# EasyEDA Pro project 工创扩展板.eprj

# Schematic Schematic1
Board Name: Board1; Create Date: 2025-02-19; Page Name: GPIO扩展功能; Project Name: 工创扩展板(1); Schematic Name: Schematic1; Update Date: 2025-02-20; Company: 嘉立创EDA; Page Size: A4; Version: V1.0
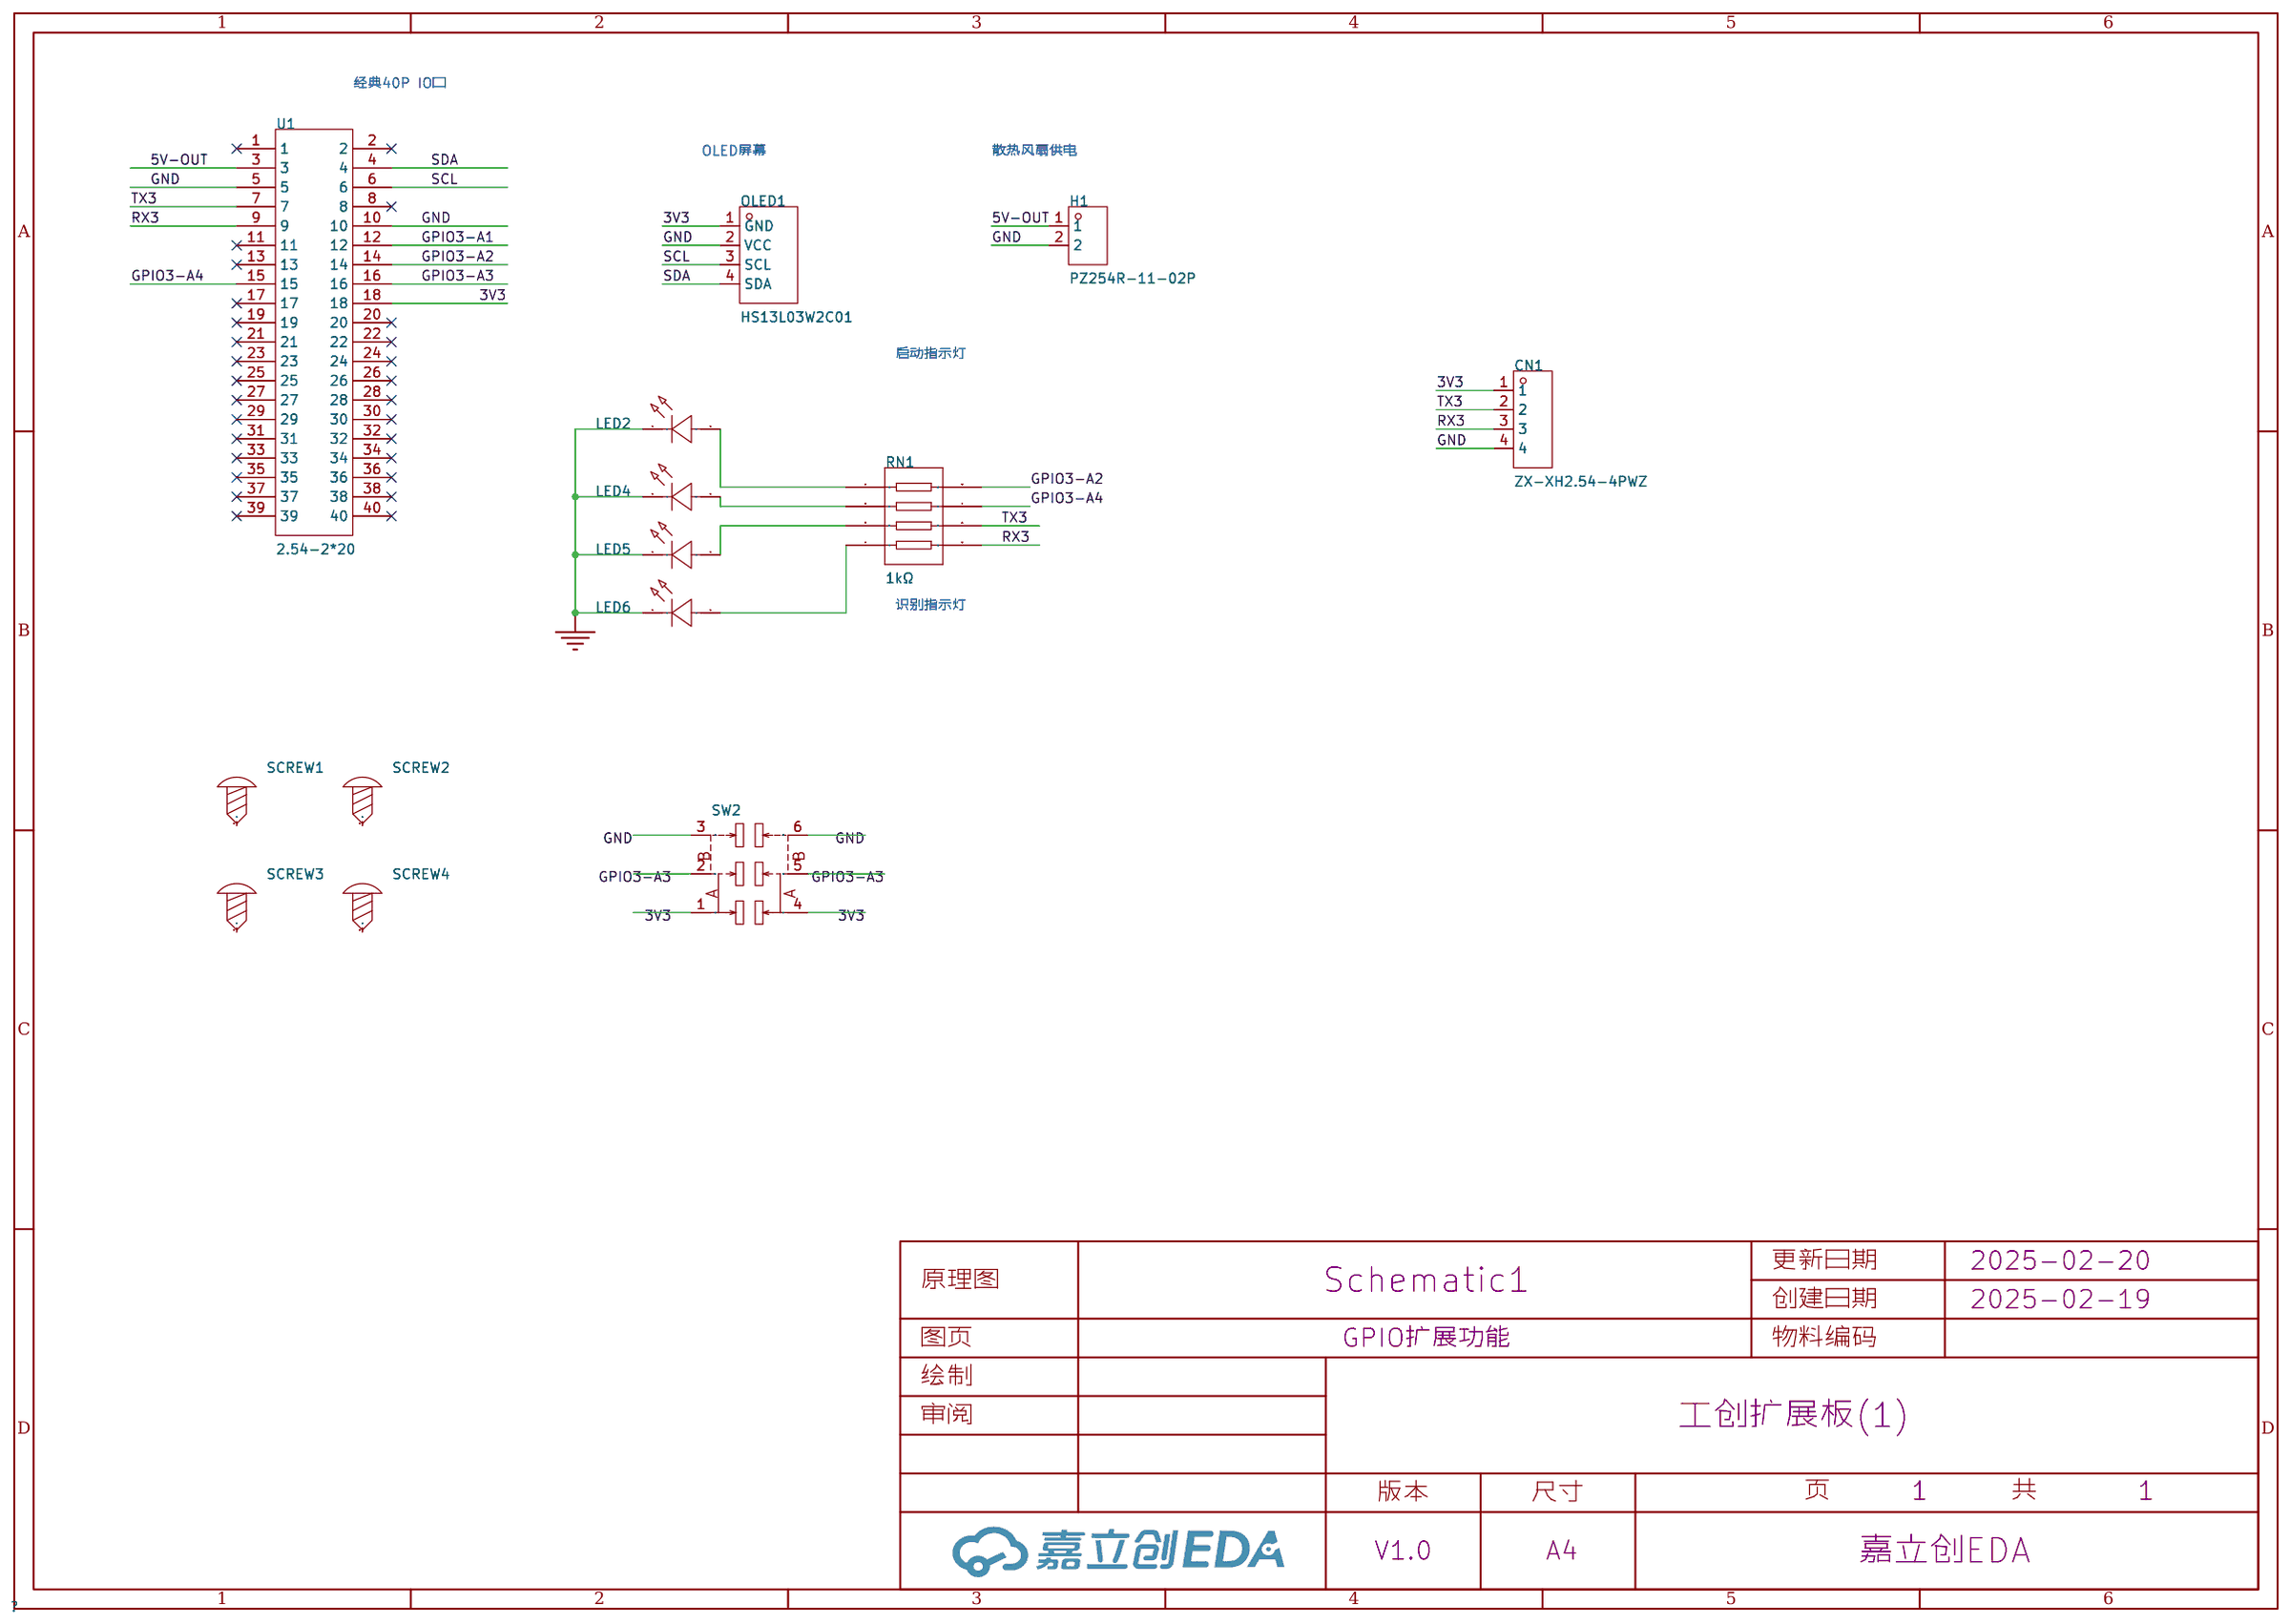
[diagram p0: schematic sheet]

## Parts
CN1  ZX-XH2.54-4PWZ  [CONN-TH_4P-P2.50_ZX-XH2.54-4PWZ]
H1  PZ254R-11-02P  [HDR-TH_2P-P2.54-H-M-W10.4]
LED2  MHT192DUGCT  [LED0603-RD]
LED4  MHT192DUGCT  [LED0603-RD]
LED5  MHT192DUGCT  [LED0603-RD]
LED6  MHT192DUGCT  [LED0603-RD]
OLED1  HS13L03W2C01  [OLED-TH_L35.4-W33.5_HS13L03W2C01]
RN1  1kΩ  [RES-ARRAY-SMD_0603-8P-L3.2-W1.6-BL]
SCREW1  -  [M3螺丝]
SCREW2  -  [M3螺丝]
SCREW3  -  [M3螺丝]
SCREW4  -  [M3螺丝]
SW2  MST22D18G2 125  [SW-SMD_MST22D18G2]
U1  2.54-2*20  [HDR-TH_40P-P2.54-V-F-R2-C20-S2.54]

## Library data of the parts
CN1 = ZX-XH2.54-4PWZ: 插针结构:1x4P;间距:2.5mm;安装方式:弯插;参考系列:XH;总PIN数:4P;排数:1;每排PIN数:4;行距:-;额定电流:3A;触头材质:黄铜;触头镀层:锡;工作温度范围:-25℃~+85℃;; LCSC Part Name: 1x4P 间距:2.5mm 弯插 系列:XH; Supplier Part: C7429643; Manufacturer: Megastar(兆星); Supplier Footprint: 弯插,P=2.5mm; JLCPCB Part Class: 扩展库; Datasheet: https://atta.szlcsc.com/upload/public/pdf/source/20230619/8DC602C7BA46C153FF1BE89D90453879.pdf; Supplier: LCSC; Pins Structure: 1x4P; Pitch: 2.5mm; Mounting Type: 弯插; Reference Series: XH; Number of Pins: 4P; Number of Rows: 1; Number of PINs Per Row: 4; Rated Current: 3A; Contact Material: 黄铜; Contact Plating: 锡; Operating Temperature: -25℃~+85℃; Rated Voltage (Max): 250V; Plastic Material: PA66; Flame Retardant Rating: UL94V-0; Color: 白色; Z-Height of the Board: 5.9mm; X-Length of Bottom Edge on Board (Spacing Line): 12.5mm; Y-Width of Bottom Edge on Board: 7.32mm
H1 = PZ254R-11-02P: 插针结构:1x2P;间距:2.54mm;行距:-;圆针/方针:方针;安装类型:弯插;排数:单排;总PIN位数:2P;额定电流:-;额定电压:-;配合针长度:6mm;塑高:2.5mm;触头材质:黄铜;触头镀层:-;工作温度范围:-40℃~+105℃;颜色:黑色;; LCSC Part Name: 间距:2.54mm 1x2P 弯插 方针; Supplier Part: C492410; Manufacturer: XFCN(兴飞); Supplier Footprint: 弯插,P=2.54mm; JLCPCB Part Class: 扩展库; Datasheet: https://atta.szlcsc.com/upload/public/pdf/source/20200309/C492410_AD20A982E51A4870F6FD4D2413672598.pdf; Supplier: LCSC; Pin Structure: 1x2P; Pitch: 2.54mm; Circluar Pins/Square Pins: 方针; Mounting Type: 弯插; Number of Rows: 单排; Number of Pins: 2P; Length of Mating Pin: 6mm; Insulation Height: 2.5mm; Contact Material: 黄铜; Operating Temperature Range: -40℃~+105℃; Color: 黑色
LED2 LED4-LED6 = MHT192DUGCT: 发光颜色:翠绿色;正向电压(VF):2.3V~2.8V;正向电流:5mA;主波长:515nm~530nm;透镜颜色:透明透镜;发光强度:285mcd~565mcd;发光角度:120°;工作温度:-40℃~+85℃;; LCSC Part Name: 0603正贴翠绿色光0.6T; Supplier Part: C7470862; Manufacturer: MEIHUA(美华); Supplier Footprint: 0603; JLCPCB Part Class: 扩展库; Datasheet: https://atta.szlcsc.com/upload/public/pdf/source/20231114/40E469906A7C8BE4964C1CB3B5553F65.pdf; Supplier: LCSC; Emitted Color: 翠绿色; Forward Voltage (VF): 2.3V~2.8V; Forward Current: 5mA; Dominant Wavelength: 515nm~530nm; Peak Wavelength: 518nm; Lens Color: 透明透镜; Luminous Intensity: 285mcd~565mcd; Viewing Angle: 120°; Operating Temperature: -40℃~+85℃
OLED1 = HS13L03W2C01: 主控芯片:SH1106;接口类型:I2C;尺寸(inch):1.3;; LCSC Part Name: 1.3'1.3寸 128*64 OLED显示屏 I2C通讯 SH1106 白光; Supplier Part: C7465997; Manufacturer: HS(汉昇); JLCPCB Part Class: 扩展库; Datasheet: https://atta.szlcsc.com/upload/public/pdf/source/20230720/8731A47396DED074CDCD72E9ACEFB46F.pdf; Supplier: LCSC; Main Control Chip: SH1106; Interface Type: I2C; Size: 1.3; Operating Temperature: -40℃~+70℃
RN1 = 4D03WGJ0102T5E: LCSC Part Name: 1kΩ ±5%; Supplier Part: C20197; Manufacturer: UNI-ROYAL(厚声); Supplier Footprint: 0603x4; JLCPCB Part Class: 基础库; Datasheet: https://atta.szlcsc.com/upload/public/pdf/source/20191224/C474318_2527498AE30E813171187CCD28401A71.pdf; Supplier: LCSC; Number of Resistors: 4; Tolerance: ±5%; Power(Watts): 62.5mW; Temperature Coefficient: ±200ppm/℃; Number of Pins: 8
SCREW1-SCREW4 = M3螺丝: Supplier Footprint: 插件
SW2 = MST22D18G2 125: 电路结构:双刀双掷;安装方式:立贴;开关颜色:黑色;额定电流(DC):100mA;额定电压(DC):12V;机械寿命:1万次;; LCSC Part Name: 拨动开关/两档立式 6脚贴片 柄长2.0mm 大六立贴 9.1*3.5mm; Supplier Part: C2906280; Manufacturer: SHOU HAN(首韩); Supplier Footprint: SMD; JLCPCB Part Class: 扩展库; Datasheet: https://atta.szlcsc.com/upload/public/pdf/source/20211019/449AD4EDF23AADA7A5C4E3C063EDBB30.pdf; Supplier: LCSC; Circuit: 双刀双掷; Pin Style: 鸥翼型; Mounting Style: 立贴; Actuator Color: 黑色; Current Rating (DC): 100mA; Voltage Rating (DC): 12V; Mechanical Life: 1万次; Operating Temperature: -25℃~+70℃
U1 = 2.54-2*20: 插孔结构:2x20P;间距:2.54mm;行距:2.54mm;圆孔/方孔:方孔;安装类型:直插;排数:双排;总孔位数:40P;额定电流:2.5A;额定电压:-;插孔方向:顶部;塑高:8.5mm;工作温度范围:-40℃~+105℃;; LCSC Part Name: 间距:2.54mm 2x20P 直插; Supplier Part: C2977589; Manufacturer: ZHOURI(洲日); Supplier Footprint: 插件,P=2.54mm; JLCPCB Part Class: 扩展库; Datasheet: https://atta.szlcsc.com/upload/public/pdf/source/20220328/834E302BE3C038BBC5C70F5E02589B1E.pdf; Supplier: LCSC; Holes Structure: 2x20P; Pitch: 2.54mm; Row Spacing: 2.54mm; Circular Hole / Square Hole: 方孔; Mounting Type: 直插; Number of Rows: 双排; Number of Holes: 40P; Current Rating (Max): 2.5A; Holes Direction: 顶部; Insulation Height: 8.5mm; Operating Temperature Range: -40℃~+105℃

## Nets
3V3: CN1.1 OLED1.1(GND) SW2.1 SW2.4 U1.18
5V-OUT: H1.1 U1.3
GND: CN1.4 H1.2 LED2.1(K) LED4.1(K) LED5.1(K) LED6.1(K) OLED1.2(VCC) SW2.3 SW2.6 U1.5 U1.10
GPIO3-A1: U1.12
GPIO3-A2: RN1.8 U1.14
GPIO3-A3: SW2.2 SW2.5 U1.16
GPIO3-A4: RN1.7 U1.15
RX3: CN1.3 RN1.5 U1.9
SCL: OLED1.3(SCL) U1.6
SDA: OLED1.4(SDA) U1.4
TX3: CN1.2 RN1.6 U1.7
$1N940: LED2.2(A) RN1.1
$1N2100: LED4.2(A) RN1.2
$1N3602: LED5.2(A) RN1.3
$1N3984: LED6.2(A) RN1.4

Not connected (* = marked no-connect by the designer): SCREW1 1; SCREW2 1; SCREW3 1; SCREW4 1; U1 1* 2* 8* 11* 13* 17* 19* 20* 21* 22* 23* 24* 25* 26* 27* 28* 29* 30* 31* 32* 33* 34* 35* 36* 37* 38* 39* 40*

## Notes on the sheet
- 经典40P IO口
- OLED屏幕
- 散热风扇供电
- 启动指示灯
- 识别指示灯

# Board PCB1
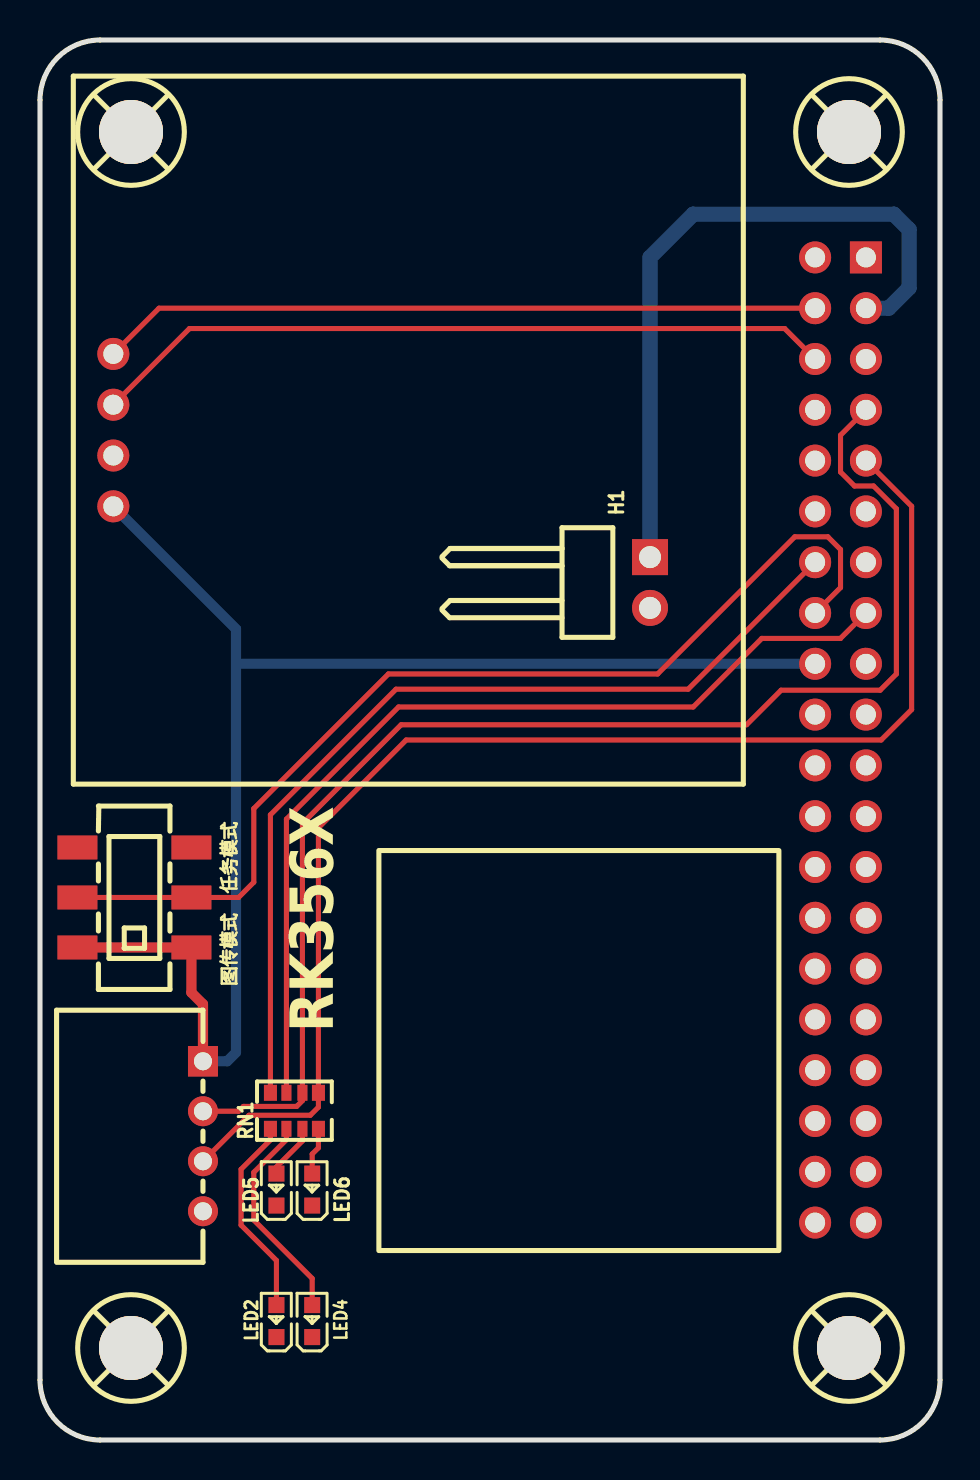
[diagram p1: board, top side]
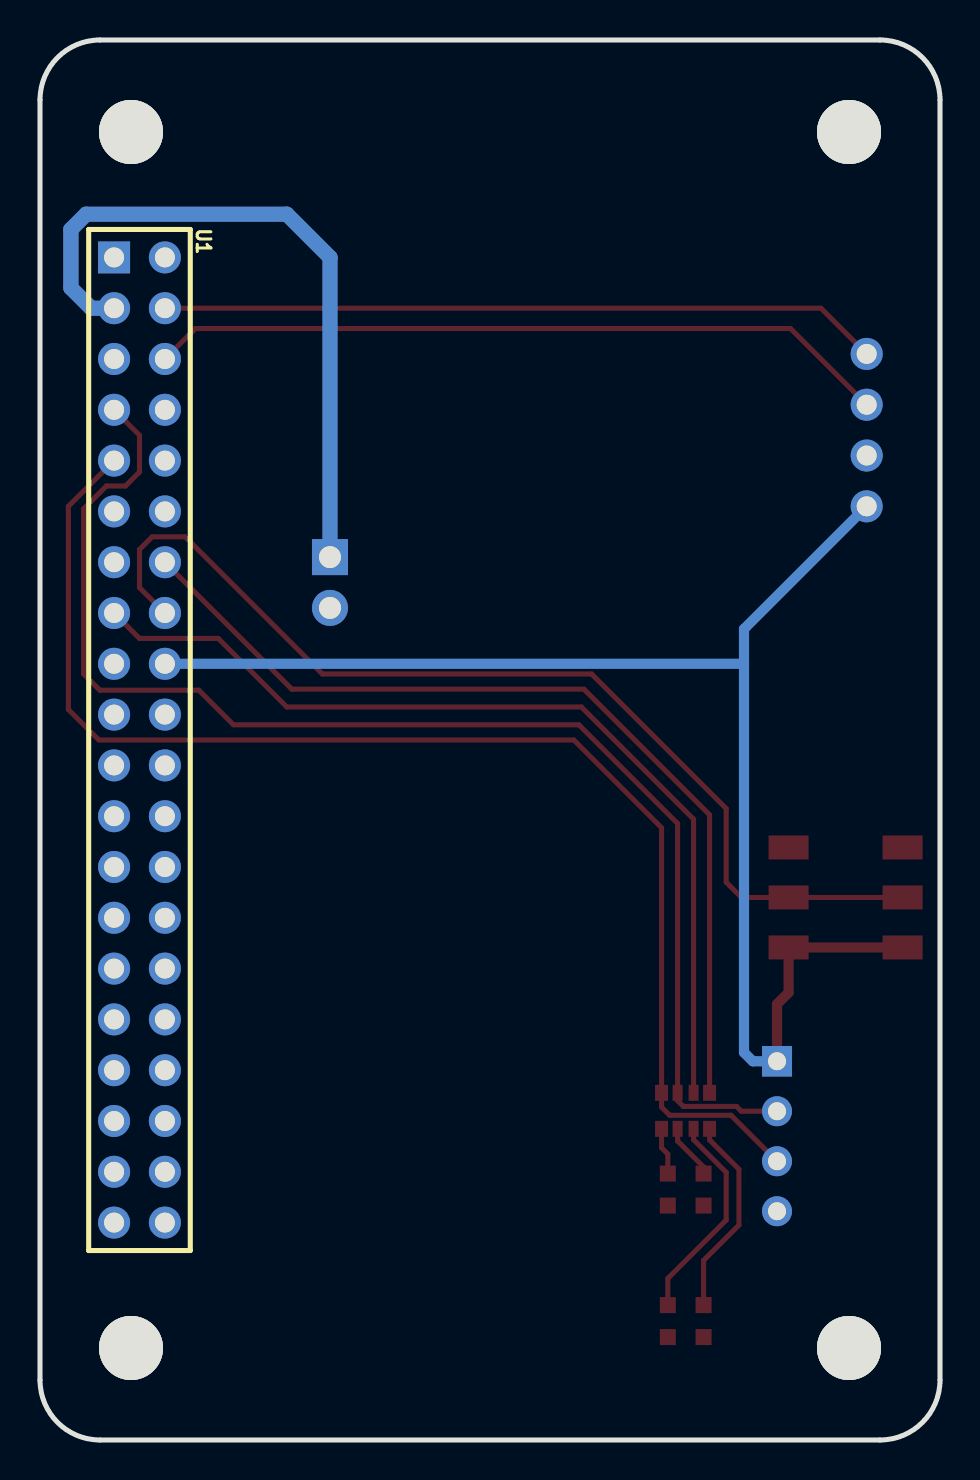
[diagram p2: board, bottom side, seen from below]

Outline 45 x 70 mm; copper layers: Top Layer, Bottom Layer. Coordinates in mm from the lower left corner of the outline.
Outline path: 0,67 0,3 arc(0.88,0.88) 3,0 42,0 arc(44.12,0.88) 45,3 45,67 arc(44.12,69.12) 42,70 3,70 arc(0.88,69.12) 0,67
Stack: Top Layer 0.035mm / Dielectric1 1.51mm FR4 er 4.5 / Bottom Layer 0.035mm

## Design rules (mm)
template: 自定义配置
spacing copperThickness1oz (default): track to track 0.102, other pairs 0.152 to 0.3
spacing copperThickness2oz: track to track 0.203, other pairs 0.152 to 0.3
track width copperThickness1oz (default): min 0.127, default 0.254, max 2.54
track width copperThickness2oz: min 0.203, default 0.254, max 2.54
differential pair differentialPair (default): width min 0.127, default 0.254, max 2.54; gap min 0.152, default 0.152
via viaSize (default): diameter min 0.5, default 0.61, max 10; hole min 0.3, default 0.305, max 6.3

## Placement (name value [footprint] x y rotation side)
CN1  ZX-XH2.54-4PWZ  [CONN-TH_4P-P2.50_ZX-XH2.54-4PWZ]  8.15 15.19 270 top
H1  PZ254R-11-02P  [HDR-TH_2P-P2.54-H-M-W10.4]  30.5 42.87 270 top
LED2  MHT192DUGCT  [LED0603-RD]  11.82 5.94 90 top
LED4  MHT192DUGCT  [LED0603-RD]  13.61 5.94 90 top
LED5  MHT192DUGCT  [LED0603-RD]  11.82 12.52 90 top
LED6  MHT192DUGCT  [LED0603-RD]  13.61 12.52 90 top
OLED1  HS13L03W2C01  [OLED-TH_L35.4-W33.5_HS13L03W2C01]  3.67 50.49 90 top
RN1  1kΩ  [RES-ARRAY-SMD_0603-8P-L3.2-W1.6-BL]  12.72 16.46 0 top
SCREW1  -  [M3螺丝]  4.55 65.4 0 top
SCREW2  -  [M3螺丝]  4.55 4.6 0 top
SCREW3  -  [M3螺丝]  40.45 65.4 0 top
SCREW4  -  [M3螺丝]  40.45 4.6 0 top
SW2  MST22D18G2 125  [SW-SMD_MST22D18G2]  4.72 27.13 90 top
U1  2.54-2*20  [HDR-TH_40P-P2.54-V-F-R2-C20-S2.54]  40.03 35 270 bottom

## Footprints (pads in the part's own frame, mm; a bottom-side part is the same pattern mirrored in y, then rotated)
CONN-TH_4P-P2.50_ZX-XH2.54-4PWZ
  rect 1.524x1.5 hole 0.9: 1(-3.75,0)
  round 1.5 hole 0.9: 2(-1.25,0) 3(1.25,0) 4(3.75,0)
HDR-TH_2P-P2.54-H-M-W10.4
  rect 1.8x1.8 hole 1.1: 1(-1.27,0)
  round 1.8 hole 1.1: 2(1.27,0)
HDR-TH_40P-P2.54-V-F-R2-C20-S2.54
  rect 1.6x1.6 hole 1: 1(-24.13,-1.27)
  round 1.6 hole 1: 2(-24.13,1.27) 3(-21.59,-1.27) 4(-21.59,1.27) 5(-19.05,-1.27) 6(-19.05,1.27) 7(-16.51,-1.27) 8(-16.51,1.27) 9(-13.97,-1.27) 10(-13.97,1.27) 11(-11.43,-1.27) 12(-11.43,1.27) 13(-8.89,-1.27) 14(-8.89,1.27) 15(-6.35,-1.27) 16(-6.35,1.27) 17(-3.81,-1.27) 18(-3.81,1.27) 19(-1.27,-1.27) 20(-1.27,1.27) 21(1.27,-1.27) 22(1.27,1.27) 23(3.81,-1.27) 24(3.81,1.27) 25(6.35,-1.27) 26(6.35,1.27) 27(8.89,-1.27) 28(8.89,1.27) 29(11.43,-1.27) 30(11.43,1.27) 31(13.97,-1.27) 32(13.97,1.27) 33(16.51,-1.27) 34(16.51,1.27) 35(19.05,-1.27) 36(19.05,1.27) 37(21.59,-1.27) 38(21.59,1.27) 39(24.13,-1.27) 40(24.13,1.27)
LED0603-RD
  rect 0.8x0.8 smd: 1(-0.799,0) 2(0.799,0)
M3螺丝
  round 3.2 hole 3.2: 1(0,0)
OLED-TH_L35.4-W33.5_HS13L03W2C01
  round 1.6 hole 1: 1(-3.81,0) 2(-1.27,0) 3(1.27,0) 4(3.81,0)
RES-ARRAY-SMD_0603-8P-L3.2-W1.6-BL
  rect 0.65x0.8 smd: 1(-1.2,-0.9) 4(1.2,-0.9) 5(1.2,0.9) 8(-1.2,0.9)
  rect 0.5x0.8 smd: 2(-0.4,-0.9) 3(0.4,-0.9) 6(0.4,0.9) 7(-0.4,0.9)
SW-SMD_MST22D18G2
  rect 1.2x2 smd: 1(-2.5,2.85) 2(0,2.85) 3(2.5,2.85) 4(-2.5,-2.85) 5(0,-2.85) 6(2.5,-2.85)

## Nets
As in the schematic.

Pads without a net: SCREW1 1; SCREW2 1; SCREW3 1; SCREW4 1; U1 1 2 8 11 13 17 19 20 21 22 23 24 25 26 27 28 29 30 31 32 33 34 35 36 37 38 39 40

## Routing (per net, layer and track width the routed paths; a pad name or vN(x,y) marks a point on that pad's centre or on a via; arc(x,y) is an arc through that point)
3V3: length 72.2
  Top Layer w0.508: CN1.1 8.15,21.79 7.57,22.37 SW2.4 SW2.1
  Bottom Layer w0.508: U1.18 9.84,38.81 ; OLED1.1 9.8,40.55 9.8,19.38 9.36,18.94 CN1.1
5V-OUT: length 34.7
  Bottom Layer w0.762: H1.1 30.5,59.13 32.66,61.29 42.69,61.29 43.46,60.53 43.46,57.61 42.44,56.59 U1.3
GPIO3-A2: length 46.4
  Top Layer w0.254: U1.14 32.41,37.54 17.8,37.54 11.52,31.26 11.52,17.36
GPIO3-A3: length 51.7
  Top Layer w0.254: U1.16 40.03,42.62 40.03,44.53 39.39,45.16 37.74,45.16 30.88,38.3 17.42,38.3 10.69,31.57 10.69,27.89 9.93,27.13 SW2.5 SW2.2
GPIO3-A4: length 46.9
  Top Layer w0.254: RN1.7 12.32,31.04 17.93,36.65 32.66,36.65 36.09,40.08 40.03,40.08 U1.15
RX3: length 66.4
  Top Layer w0.254: U1.9 43.58,46.68 43.58,36.52 42.06,35 18.31,35 13.92,30.61 RN1.5 13.92,16.64 13.52,16.24 10.45,16.24 CN1.3
SCL: length 37.3
  Top Layer w0.254: U1.6 37.23,55.57 7.48,55.57 OLED1.3
SDA: length 36
  Top Layer w0.254: U1.4 5.95,56.59 OLED1.4
TX3: length 67.3
  Top Layer w0.254: CN1.2 9.93,16.44 10.17,16.68 12.83,16.68 13.12,16.97 RN1.6 13.12,30.83 18.06,35.76 35.33,35.76 37.05,37.49 42.01,37.49 42.82,38.3 42.82,46.56 41.68,47.7 40.72,47.7 40.03,48.4 40.03,50.24 U1.7
$1N940: length 10.2
  Top Layer w0.254: 11.52,15.56 11.52,15 10.05,13.54 10.05,10.74 11.82,8.98 LED2.2
$1N2100: length 10.7
  Top Layer w0.254: LED4.2 13.61,8.08 10.69,11 10.69,13.38 12.32,15.01 RN1.2
$1N3602: length 2.8
  Top Layer w0.254: RN1.3 13.12,14.95 11.82,13.65 LED5.2
$1N3984: length 2.4
  Top Layer w0.254: LED6.2 13.61,14.3 13.92,14.61 RN1.4

## Text on the board
Top Solder Mask Layer: GDOU | IVEN | AnAn | Full Stack Engineer | Visual Engineer
Top Silkscreen Layer: RK356X | 任务模式 | 图传模式
